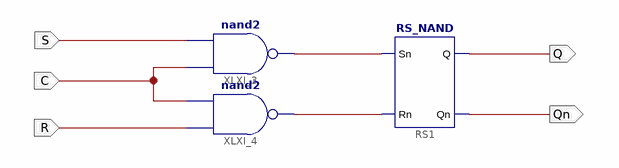
[diagram p0: schematic sheet 1]
// Xilinx ISE schematic RS_EN.sch (kintex7) as structural Verilog: 3 symbols, 5 ports
module RS_EN (
  input  C,
  input  S,
  input  R,
  output Q,
  output Qn
);

  wire XLXN_6, XLXN_7;

  RS_NAND RS1 (.Sn(XLXN_6), .Rn(XLXN_7), .Qn(Qn), .Q(Q));
  nand XLXI_3 (XLXN_6, C, S);
  nand XLXI_4 (XLXN_7, R, C);
endmodule
